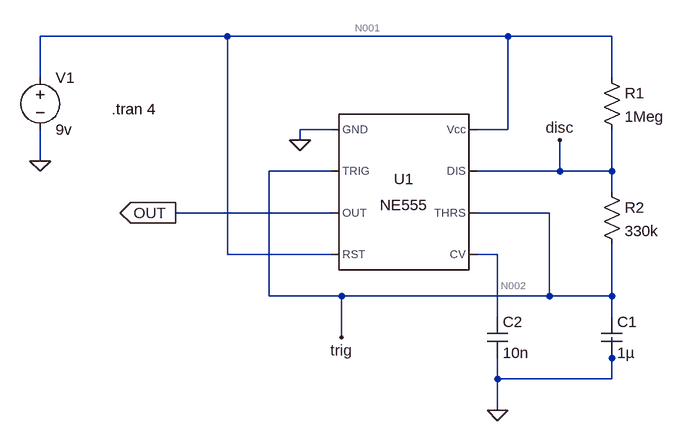
[diagram p0: schematic electronics_555_astable_1.asc]
electronics_555_astable_1.asc, the LTspice schematic file:
Version 4
SHEET 1 880 680
WIRE -192 -80 -480 -80
WIRE 240 -80 -192 -80
WIRE 400 -80 240 -80
WIRE -480 -16 -480 -80
WIRE 400 -16 400 -80
WIRE -32 64 -80 64
WIRE 240 64 240 -80
WIRE 240 64 192 64
WIRE -80 80 -80 64
WIRE -480 112 -480 64
WIRE -32 128 -128 128
WIRE 320 128 320 80
WIRE 320 128 192 128
WIRE 400 128 400 64
WIRE 400 128 320 128
WIRE 400 160 400 128
WIRE -32 192 -272 192
WIRE 304 192 192 192
WIRE -192 256 -192 -80
WIRE -32 256 -192 256
WIRE 224 256 192 256
WIRE -128 320 -128 128
WIRE -16 320 -128 320
WIRE 304 320 304 192
WIRE 304 320 -16 320
WIRE 400 320 400 240
WIRE 400 320 304 320
WIRE 224 352 224 256
WIRE 400 352 400 320
WIRE -16 384 -16 320
WIRE 400 416 400 384
WIRE 224 448 224 416
WIRE 400 448 400 416
WIRE 400 448 224 448
WIRE 224 496 224 448
FLAG -80 80 0
FLAG 224 496 0
FLAG -480 112 0
FLAG -272 192 OUT
IOPIN -272 192 Out
FLAG -16 384 trig
FLAG 320 80 disc
SYMBOL Misc\\NE555 80 160 R0
SYMATTR InstName U1
SYMBOL voltage -480 -32 R0
WINDOW 123 0 0 Left 0
WINDOW 39 0 0 Left 0
SYMATTR InstName V1
SYMATTR Value 9v
SYMBOL res 384 -32 R0
SYMATTR InstName R1
SYMATTR Value 1Meg
SYMBOL res 384 144 R0
SYMATTR InstName R2
SYMATTR Value 330k
SYMBOL cap 384 352 R0
SYMATTR InstName C1
SYMATTR Value 1µ
SYMBOL cap 208 352 R0
SYMATTR InstName C2
SYMATTR Value 10n
TEXT -370 32 Left 2 !.tran 4

The netlist it stands for:
* electronics_555_astable_1.asc
XU1 0 trig OUT N001 N002 trig disc N001 NE555  ; pins GND TRIG OUT RST CV THRS DIS Vcc
V1 N001 0 9v
R1 N001 disc 1Meg
R2 disc trig 330k
C1 trig 0 1µ
C2 N002 0 10n
.tran 4
.lib NE555.sub
.backanno
.end

* Results of the author's LTspice run, read from the files saved beside the schematic
* Operating Point, zero values left out:
*   V(trig) = 8.964 V
*   V(n002) = 6 V
*   V(n001) = 9 V
*   V(disc) = 8.97 V
*   V(out) = 9 V
*   I(R1) = 29.9 nA
*   I(R2) = 17.93 nA
*   I(V1) = -2.908 mA
*   Ix(u1:1) = -2.908 mA
*   Ix(u1:2) = 8.964 nA
*   Ix(u1:4) = 49.33 µA
*   Ix(u1:6) = 8.964 nA
*   Ix(u1:7) = 11.97 nA
*   Ix(u1:8) = 2.859 mA
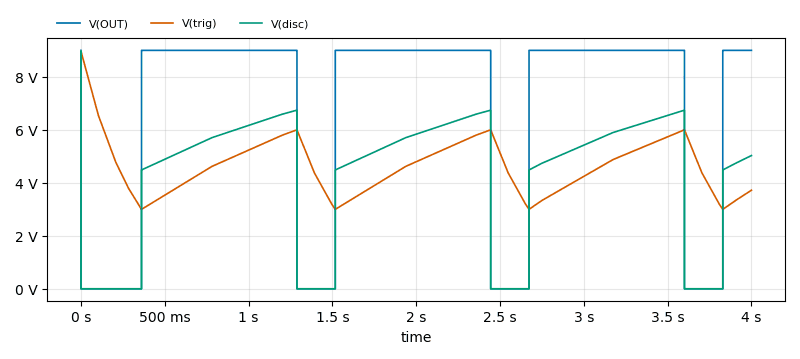
[diagram p1: Transient Analysis of electronics_555_astable_1.asc, plotted from the saved traces]
* Transient Analysis, 1 run:
*   V(OUT): min 54 µV, max 9 V, average 6.643 V, rms 7.732 V, last 9 V
*   V(trig): min 2.999 V, max 8.964 V, average 4.614 V, rms 4.761 V, last 3.722 V
*   V(disc): min 108.5 µV, max 8.97 V, average 4.181 V, rms 4.913 V, last 5.03 V